# EasyEDA Pro project KeyTop.epro

# Schematic KeyTop
Board Name: KeyTop; Create Date: 2026-04-17; Page Name: Sheet_1; Project Name: Keytop; Schematic Name: KeyTop; Update Date: 2026-05-10; Add into BOM: yes; Company: Trust me bro; Convert to PCB: yes; Date: 2026-04-16; REV: 1.0; Sheet: 1/1; spicePre: .
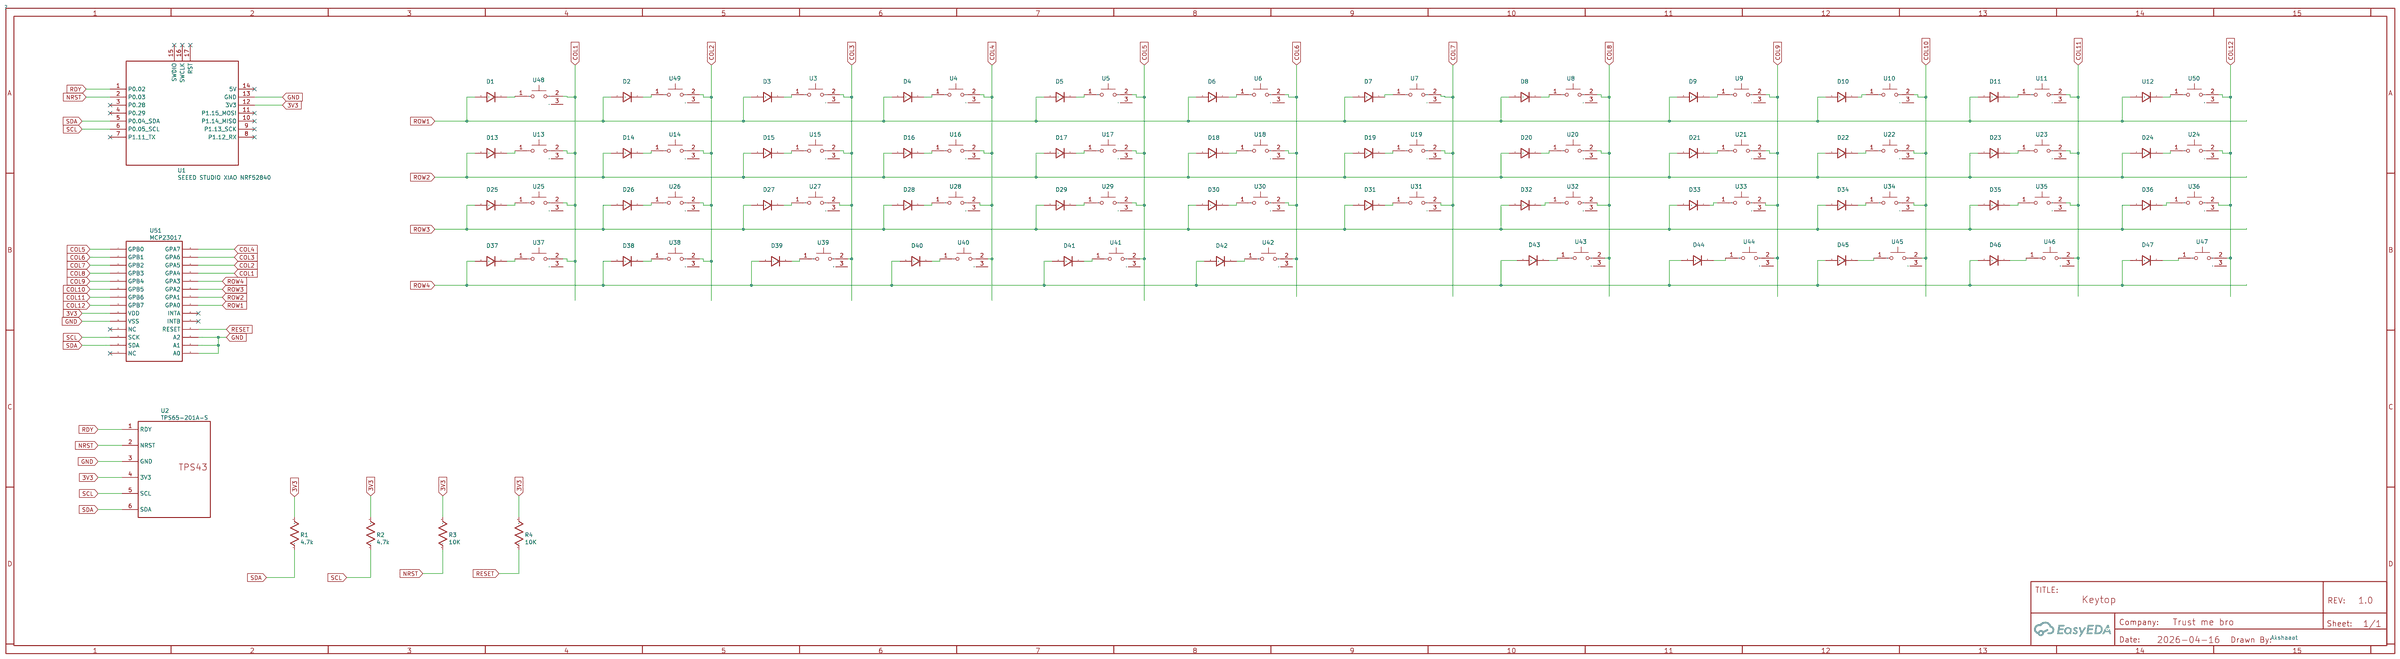
[diagram p0: schematic sheet]

## Parts
D1  1N4148  [SOD-123_L2.8-W1.8-LS3.7-RD]
D2  1N4148  [SOD-123_L2.8-W1.8-LS3.7-RD]
D3  1N4148  [SOD-123_L2.8-W1.8-LS3.7-RD]
D4  1N4148  [SOD-123_L2.8-W1.8-LS3.7-RD]
D5  1N4148  [SOD-123_L2.8-W1.8-LS3.7-RD]
D6  1N4148  [SOD-123_L2.8-W1.8-LS3.7-RD]
D7  1N4148  [SOD-123_L2.8-W1.8-LS3.7-RD]
D8  1N4148  [SOD-123_L2.8-W1.8-LS3.7-RD]
D9  1N4148  [SOD-123_L2.8-W1.8-LS3.7-RD]
D10  1N4148  [SOD-123_L2.8-W1.8-LS3.7-RD]
D11  1N4148  [SOD-123_L2.8-W1.8-LS3.7-RD]
D13  1N4148  [SOD-123_L2.8-W1.8-LS3.7-RD]
D14  1N4148  [SOD-123_L2.8-W1.8-LS3.7-RD]
D15  1N4148  [SOD-123_L2.8-W1.8-LS3.7-RD]
D16  1N4148  [SOD-123_L2.8-W1.8-LS3.7-RD]
D17  1N4148  [SOD-123_L2.8-W1.8-LS3.7-RD]
D18  1N4148  [SOD-123_L2.8-W1.8-LS3.7-RD]
D19  1N4148  [SOD-123_L2.8-W1.8-LS3.7-RD]
D20  1N4148  [SOD-123_L2.8-W1.8-LS3.7-RD]
D21  1N4148  [SOD-123_L2.8-W1.8-LS3.7-RD]
D22  1N4148  [SOD-123_L2.8-W1.8-LS3.7-RD]
D23  1N4148  [SOD-123_L2.8-W1.8-LS3.7-RD]
D24  1N4148  [SOD-123_L2.8-W1.8-LS3.7-RD]
D25  1N4148  [SOD-123_L2.8-W1.8-LS3.7-RD]
D26  1N4148  [SOD-123_L2.8-W1.8-LS3.7-RD]
D27  1N4148  [SOD-123_L2.8-W1.8-LS3.7-RD]
D28  1N4148  [SOD-123_L2.8-W1.8-LS3.7-RD]
D29  1N4148  [SOD-123_L2.8-W1.8-LS3.7-RD]
D30  1N4148  [SOD-123_L2.8-W1.8-LS3.7-RD]
D31  1N4148  [SOD-123_L2.8-W1.8-LS3.7-RD]
D32  1N4148  [SOD-123_L2.8-W1.8-LS3.7-RD]
D33  1N4148  [SOD-123_L2.8-W1.8-LS3.7-RD]
D34  1N4148  [SOD-123_L2.8-W1.8-LS3.7-RD]
D35  1N4148  [SOD-123_L2.8-W1.8-LS3.7-RD]
D36  1N4148  [SOD-123_L2.8-W1.8-LS3.7-RD]
D37  1N4148  [SOD-123_L2.8-W1.8-LS3.7-RD]
D38  1N4148  [SOD-123_L2.8-W1.8-LS3.7-RD]
D39  1N4148  [SOD-123_L2.8-W1.8-LS3.7-RD]
D40  1N4148  [SOD-123_L2.8-W1.8-LS3.7-RD]
D41  1N4148  [SOD-123_L2.8-W1.8-LS3.7-RD]
D42  1N4148  [SOD-123_L2.8-W1.8-LS3.7-RD]
D43  1N4148  [SOD-123_L2.8-W1.8-LS3.7-RD]
D44  1N4148  [SOD-123_L2.8-W1.8-LS3.7-RD]
D45  1N4148  [SOD-123_L2.8-W1.8-LS3.7-RD]
D46  1N4148  [SOD-123_L2.8-W1.8-LS3.7-RD]
D47  1N4148  [SOD-123_L2.8-W1.8-LS3.7-RD]
R1  4.7k  [R0603]
R2  4.7k  [R0603]
R3  10K  [R0603]
R4  10K  [R0603]
U1  SEEED STUDIO XIAO NRF52840  [SEEED STUDIO XIAO NRF52840]
U2  TPS65-201A-S  [TPS65-201A-S]
U3  CPG135301D02  [KEY-TH_CPG135301D02]
U4  CPG135301D02  [KEY-TH_CPG135301D02]
U5  CPG135301D02  [KEY-TH_CPG135301D02]
U6  CPG135301D02  [KEY-TH_CPG135301D02]
U7  CPG135301D02  [KEY-TH_CPG135301D02]
U8  CPG135301D02  [KEY-TH_CPG135301D02]
U9  CPG135301D02  [KEY-TH_CPG135301D02]
U10  CPG135301D02  [KEY-TH_CPG135301D02]
U11  CPG135301D02  [KEY-TH_CPG135301D02]
U12  1N4148  [SOD-123_L2.8-W1.8-LS3.7-RD]
U13  CPG135301D02  [KEY-TH_CPG135301D02]
U14  CPG135301D02  [KEY-TH_CPG135301D02]
U15  CPG135301D02  [KEY-TH_CPG135301D02]
U16  CPG135301D02  [KEY-TH_CPG135301D02]
U17  CPG135301D02  [KEY-TH_CPG135301D02]
U18  CPG135301D02  [KEY-TH_CPG135301D02]
U19  CPG135301D02  [KEY-TH_CPG135301D02]
U20  CPG135301D02  [KEY-TH_CPG135301D02]
U21  CPG135301D02  [KEY-TH_CPG135301D02]
U22  CPG135301D02  [KEY-TH_CPG135301D02]
U23  CPG135301D02  [KEY-TH_CPG135301D02]
U24  CPG135301D02  [KEY-TH_CPG135301D02]
U25  CPG135301D02  [KEY-TH_CPG135301D02]
U26  CPG135301D02  [KEY-TH_CPG135301D02]
U27  CPG135301D02  [KEY-TH_CPG135301D02]
U28  CPG135301D02  [KEY-TH_CPG135301D02]
U29  CPG135301D02  [KEY-TH_CPG135301D02]
U30  CPG135301D02  [KEY-TH_CPG135301D02]
U31  CPG135301D02  [KEY-TH_CPG135301D02]
U32  CPG135301D02  [KEY-TH_CPG135301D02]
U33  CPG135301D02  [KEY-TH_CPG135301D02]
U34  CPG135301D02  [KEY-TH_CPG135301D02]
U35  CPG135301D02  [KEY-TH_CPG135301D02]
U36  CPG135301D02  [KEY-TH_CPG135301D02]
U37  CPG135301D02  [KEY-TH_CPG135301D02]
U38  CPG135301D02  [KEY-TH_CPG135301D02]
U39  CPG135301D02  [KEY-TH_CPG135301D02]
U40  CPG135301D02  [KEY-TH_CPG135301D02]
U41  CPG135301D02  [KEY-TH_CPG135301D02]
U42  CPG135301D02  [KEY-TH_CPG135301D02]
U43  CPG135301D02  [KEY-TH_CPG135301D02]
U44  CPG135301D02  [KEY-TH_CPG135301D02]
U45  CPG135301D02  [KEY-TH_CPG135301D02]
U46  CPG135301D02  [KEY-TH_CPG135301D02]
U47  CPG135301D02  [KEY-TH_CPG135301D02]
U48  CPG135301D02  [KEY-TH_CPG135301D02]
U49  CPG135301D02  [KEY-TH_CPG135301D02]
U50  CPG135301D02  [KEY-TH_CPG135301D02]
U51  MCP23017  [MCP23017-E/SP]

## Library data of the parts
D1-D11 D13-D47 U12 = 1N4148: Supplier: LCSC; Supplier Part: C328592; Manufacturer: BLUE ROCKET; Manufacturer Part: 1N4007W; Contributor: LCEDA_Lib; spicePre: D; spiceSymbolName: 1N4007W
R1 R2 = 4.7k: nameAlias: Value(Ω); Contributor: LCEDA_Lib; spicePre: R; spiceSymbolName: R_0603_US
R3 R4 = 10K: nameAlias: Value(Ω); Contributor: LCEDA_Lib; spicePre: R; spiceSymbolName: R_0603_US
U1 = SEEED STUDIO XIAO NRF52840: Contributor: hafeneger; spicePre: U
U2 = TPS65-201A-S: Manufacturer: Azoteq; Supplier: Mouser; Supplier Part: 957-TPS65-201A-S; Link: https://www.mouser.pl/ProductDetail/Azoteq/TPS65-201A-S; Contributor: ilysnwflk; spicePre: U
U3-U11 U13-U50 = CPG135301D02: Supplier Part: C5142796; Manufacturer: Kailh(凯华); Supplier Footprint: 插件; JLCPCB Part Class: Extended Part; Datasheet: https://atta.szlcsc.com/upload/public/pdf/source/20240306/2B4750D694E677D5EFD80A0C9CA73C95.pdf; Supplier: LCSC
U51 = MCP23017: Contributor: bartvanhecke; spicePre: U

## Nets
3V3: R1.2 R2.2 R3.2 R4.2 U1.12(3V3) U2.4(3V3) U51.9(VDD)
GND: U1.13(GND) U2.3(GND) U51.10(VSS) U51.15(A0) U51.16(A1) U51.17(A2)
COL1: U13.2 U25.2 U37.2 U48.2 U51.25(GPA4)
COL2: U14.2 U26.2 U38.2 U49.2 U51.26(GPA5)
COL3: U3.2 U15.2 U27.2 U39.2 U51.27(GPA6)
COL4: U4.2 U16.2 U28.2 U40.2 U51.28(GPA7)
COL5: U5.2 U17.2 U29.2 U41.2 U51.1(GPB0)
COL6: U6.2 U18.2 U30.2 U42.2 U51.2(GPB1)
COL7: U7.2 U19.2 U31.2 U51.3(GPB2)
COL8: U8.2 U20.2 U32.2 U43.2 U51.4(GPB3)
COL9: U9.2 U21.2 U33.2 U44.2 U51.5(GPB4)
COL10: U10.2 U22.2 U34.2 U45.2 U51.6(GPB5)
COL11: U11.2 U23.2 U35.2 U46.2 U51.7(GPB6)
COL12: U24.2 U36.2 U47.2 U50.2 U51.8(GPB7)
NRST: R3.1 U1.2(P0.03) U2.2(NRST)
RDY: U1.1(P0.02) U2.1(RDY)
RESET: R4.1 U51.18(RESET)
ROW1: D1.2 D2.2 D3.2 D4.2 D5.2 D6.2 D7.2 D8.2 D9.2 D10.2 D11.2 U12.2 U51.21(GPA0)
ROW2: D13.2 D14.2 D15.2 D16.2 D17.2 D18.2 D19.2 D20.2 D21.2 D22.2 D23.2 D24.2 U51.22(GPA1)
ROW3: D25.2 D26.2 D27.2 D28.2 D29.2 D30.2 D31.2 D32.2 D33.2 D34.2 D35.2 D36.2 U51.23(GPA2)
ROW4: D37.2 D38.2 D39.2 D40.2 D41.2 D42.2 D43.2 D44.2 D45.2 D46.2 D47.2 U51.24(GPA3)
SCL: R2.1 U1.6(P0.05_SCL) U2.5(SCL) U51.12(SCK)
SDA: R1.1 U1.5(P0.04_SDA) U2.6(SDA) U51.13(SDA)
$1N28: D1.1 U48.1
$1N29: D2.1 U49.1
$1N30: D3.1 U3.1
$1N31: D4.1 U4.1
$1N32: D5.1 U5.1
$1N33: D6.1 U6.1
$1N34: D7.1 U7.1
$1N35: D8.1 U8.1
$1N36: D9.1 U9.1
$1N37: D10.1 U10.1
$1N38: D11.1 U11.1
$1N39: U12.1 U50.1
$1N40: D13.1 U13.1
$1N41: D14.1 U14.1
$1N42: D15.1 U15.1
$1N43: D16.1 U16.1
$1N44: D17.1 U17.1
$1N45: D18.1 U18.1
$1N46: D19.1 U19.1
$1N47: D20.1 U20.1
$1N48: D21.1 U21.1
$1N49: D22.1 U22.1
$1N50: D23.1 U23.1
$1N51: D24.1 U24.1
$1N52: D25.1 U25.1
$1N53: D26.1 U26.1
$1N54: D27.1 U27.1
$1N55: D28.1 U28.1
$1N56: D29.1 U29.1
$1N57: D30.1 U30.1
$1N58: D31.1 U31.1
$1N59: D32.1 U32.1
$1N60: D33.1 U33.1
$1N61: D34.1 U34.1
$1N62: D35.1 U35.1
$1N63: D36.1 U36.1
$1N64: D37.1 U37.1
$1N65: D38.1 U38.1
$1N66: D39.1 U39.1
$1N67: D40.1 U40.1
$1N68: D41.1 U41.1
$1N69: D42.1 U42.1
$1N70: D43.1 U43.1
$1N71: D44.1 U44.1
$1N72: D45.1 U45.1
$1N73: D46.1 U46.1
$1N74: D47.1 U47.1

Not connected (* = marked no-connect by the designer): U1 3(P0.28)* 4(P0.29)* 7(P1.11_TX)* 8(P1.12_RX)* 9(P1.13_SCK)* 10(P1.14_MISO)* 11(P1.15_MOSI)* 14(5V)* 15(SWDIO)* 16(SWCLK)* 17(RST)*; U3 3; U4 3; U5 3; U6 3; U7 3; U8 3; U9 3; U10 3; U11 3; U13 3; U14 3; U15 3; U16 3; U17 3; U18 3; U19 3; U20 3; U21 3; U22 3; U23 3; U24 3; U25 3; U26 3; U27 3; U28 3; U29 3; U30 3; U31 3; U32 3; U33 3; U34 3; U35 3; U36 3; U37 3; U38 3; U39 3; U40 3; U41 3; U42 3; U43 3; U44 3; U45 3; U46 3; U47 3; U48 3; U49 3; U50 3; U51 11(NC)* 14(NC)* 19(INTB)* 20(INTA)*

## Notes on the sheet
- Akshaaat

# Board PCB_PCB_KeyTop_2026-04-17
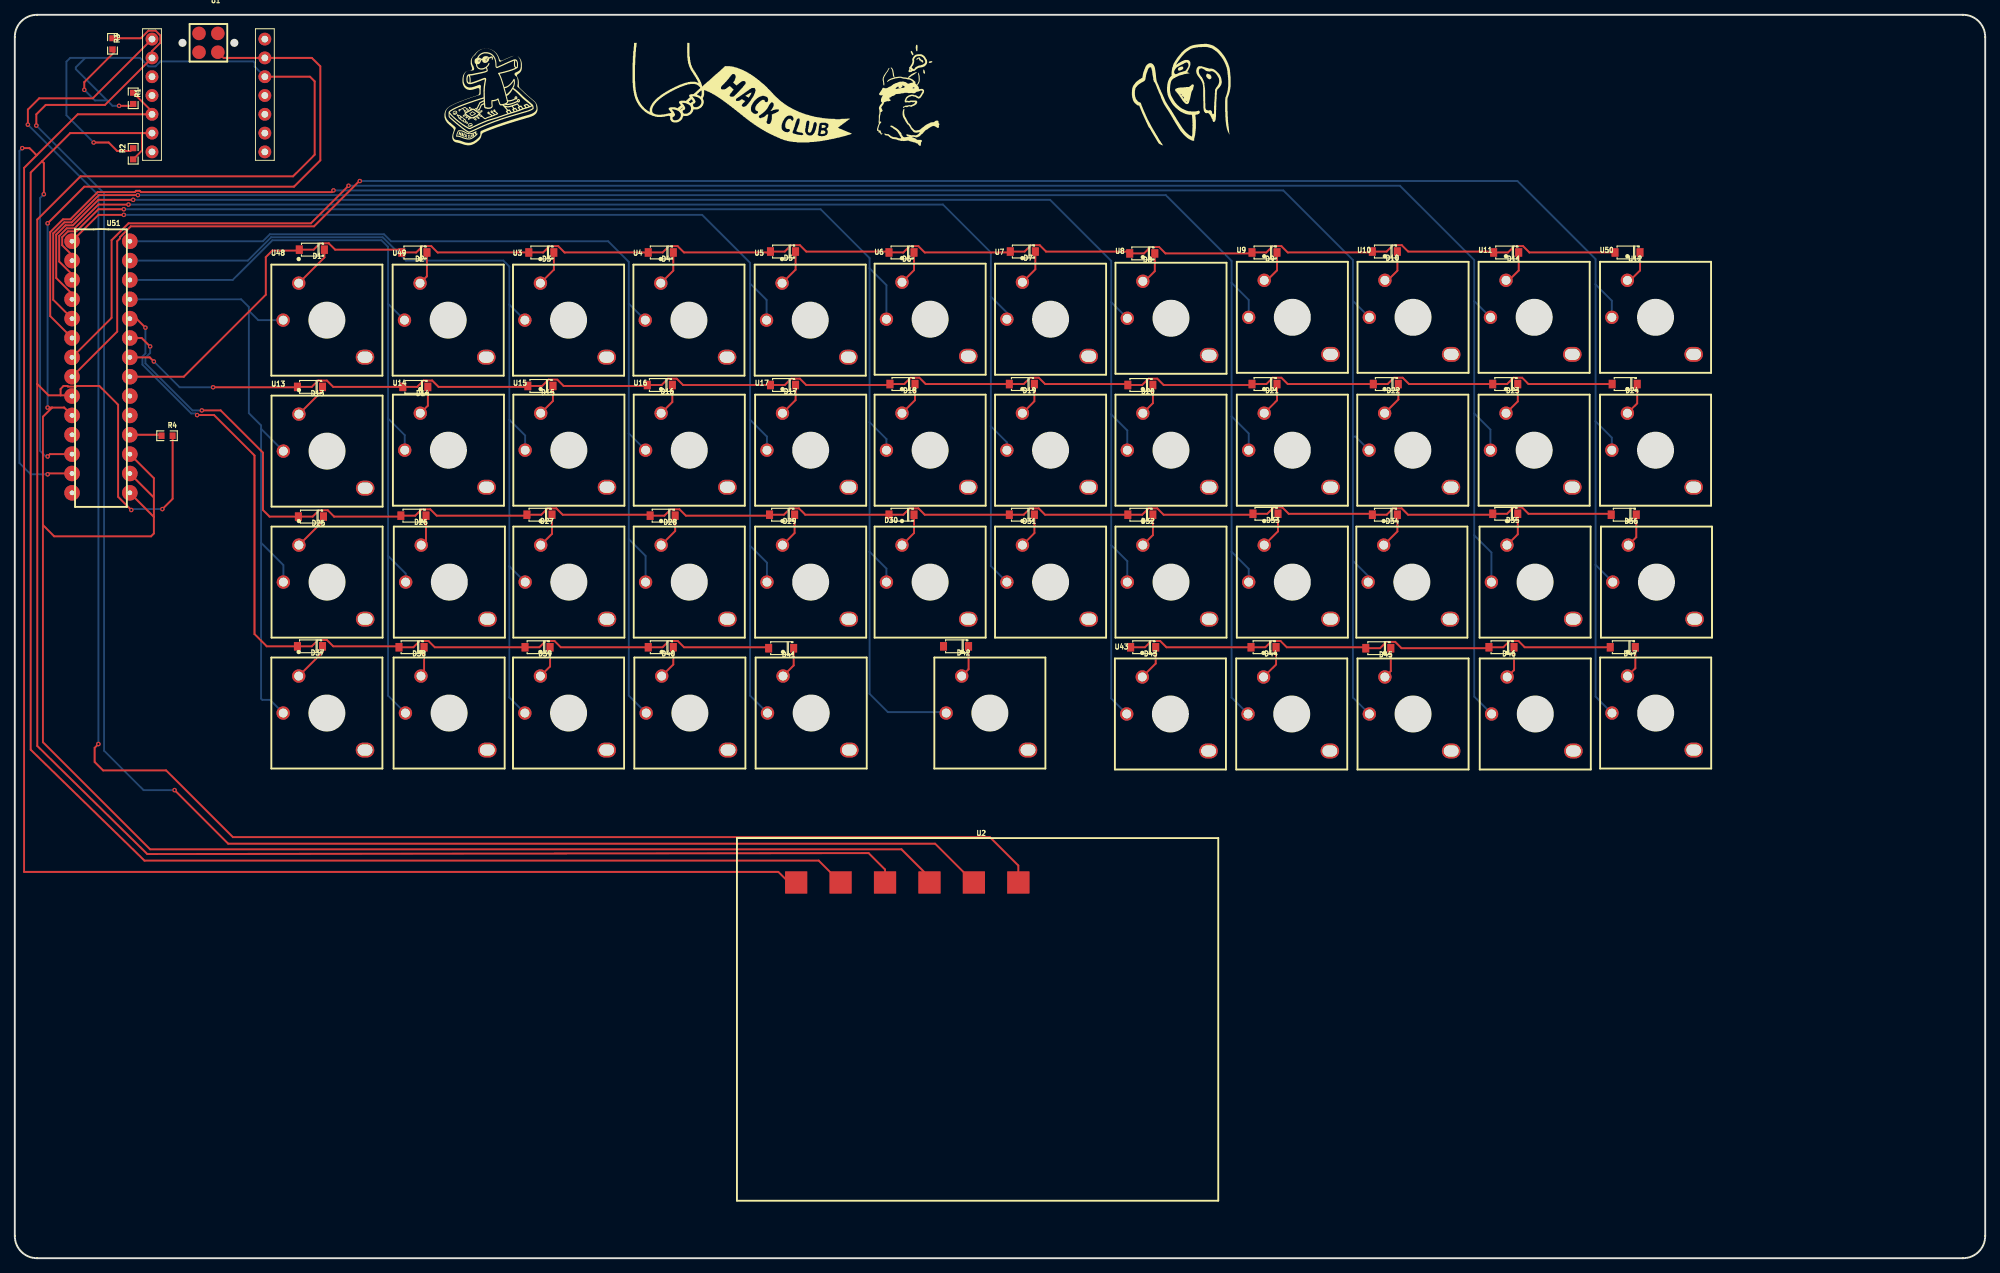
[diagram p1: board, top side]
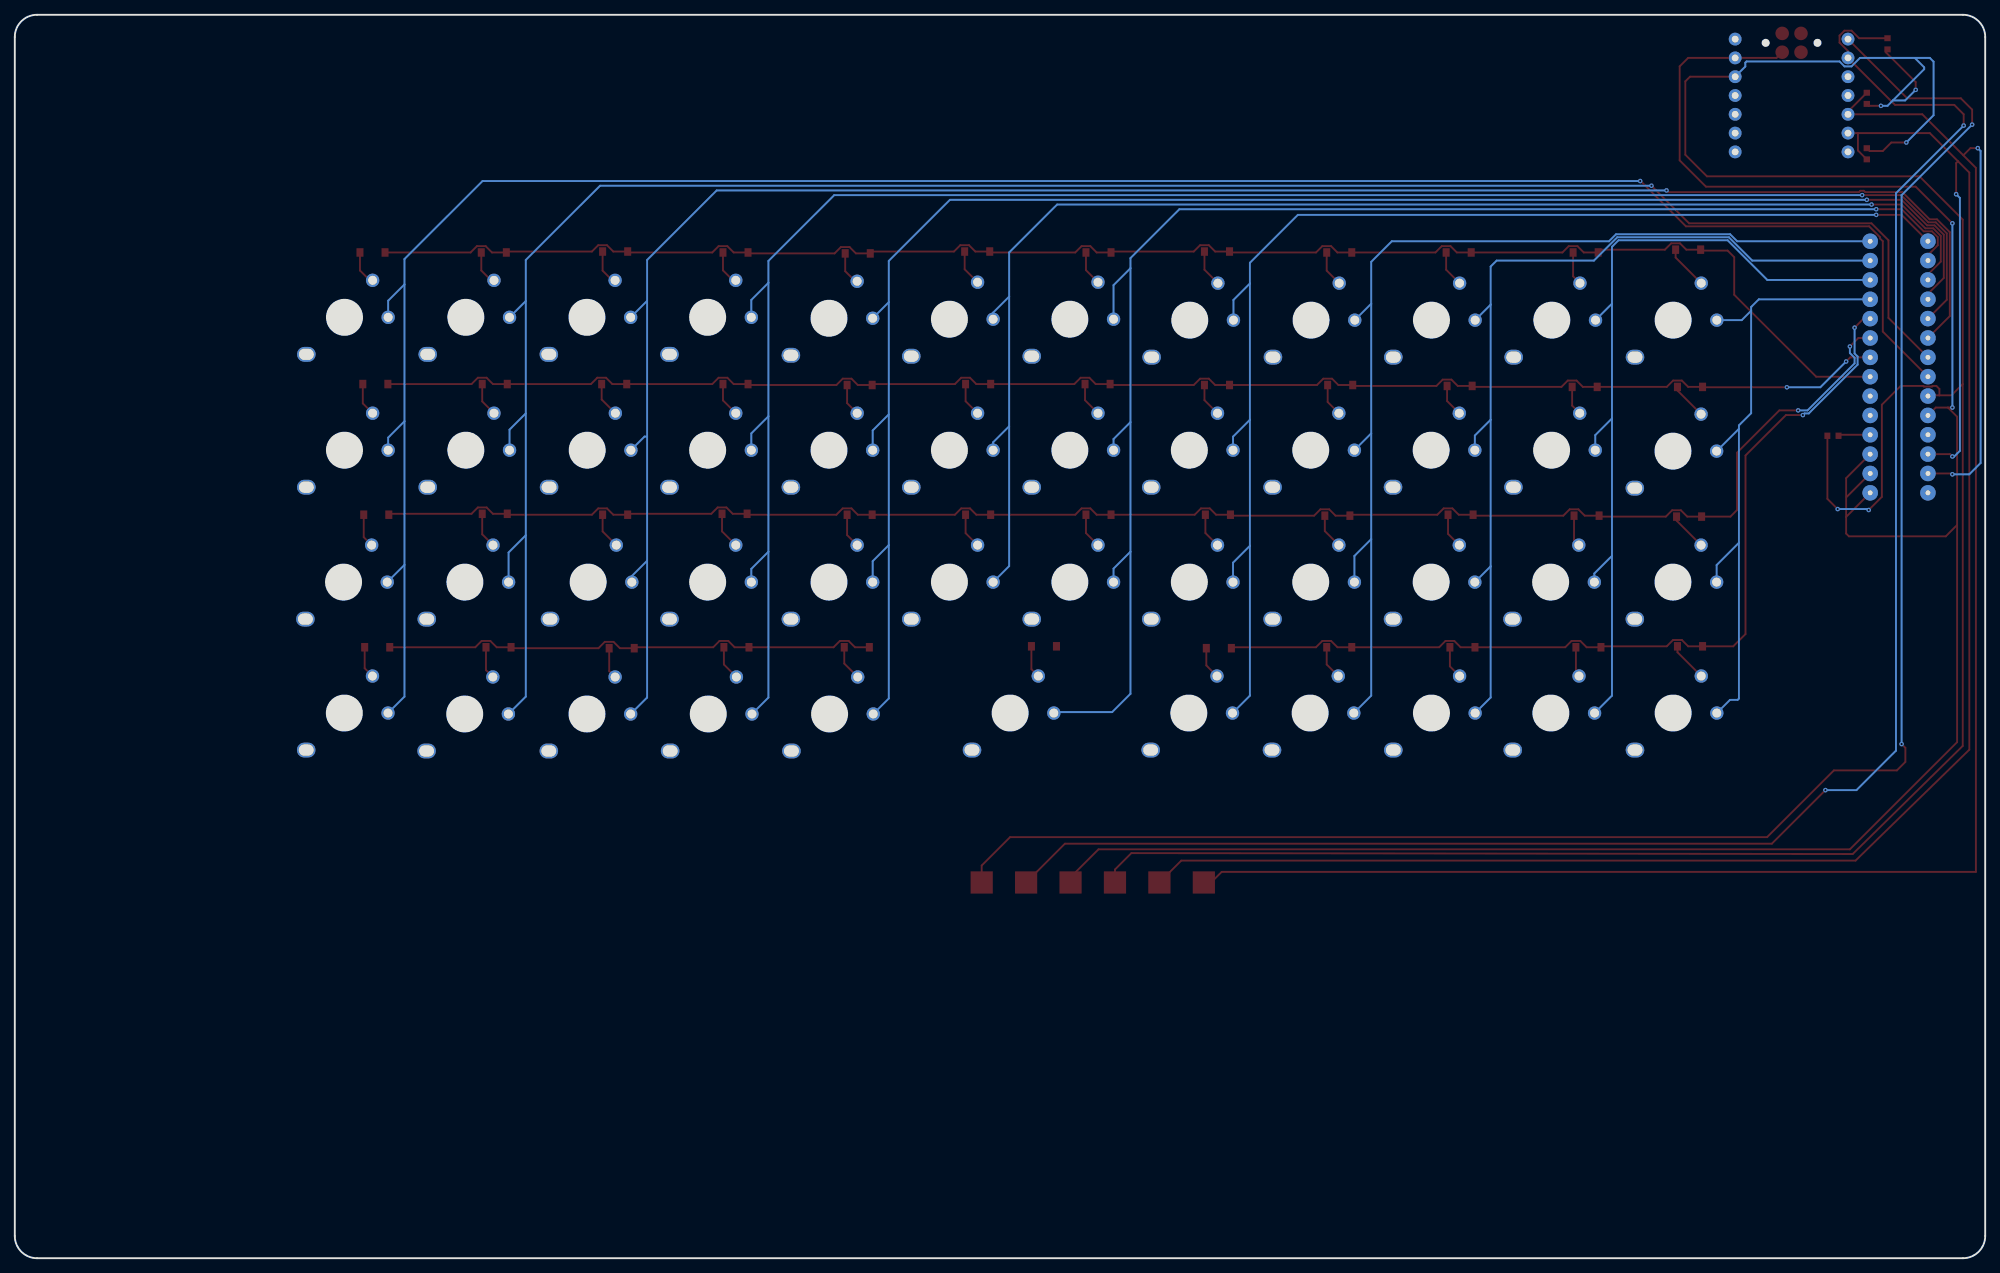
[diagram p2: board, bottom side, seen from below]

Outline 266.1 x 168 mm; copper layers: Top Layer, Bottom Layer. Coordinates in mm from the lower left corner of the outline.
Outline path: 0,165 arc(0.88,167.12) 3,168 263.1,168 arc(265.22,167.12) 266.1,165 266.1,3 arc(265.22,0.88) 263.1,0 3,0 arc(0.88,0.88) 0,3 0,165
Stack: Top Layer 0.035mm / Dielectric1 1.51mm FR4 er 4.5 / Bottom Layer 0.035mm

## Design rules (mm)
spacing Default (default): track to track 0.152, other pairs 0 to 0.152
track width Default (default): min 0.254, default 0.254, max 25.4
differential pair differentialPair (default): width min 0.127, default 0.254, max 2.54; gap min 0.152, default 0.152
via Default (default): diameter min 0.61, default 0.61, max 100.025; hole min 0.305, default 0.305, max 59.995

## Placement (name value [footprint] x y rotation side)
D1  1N4148  [SOD-123_L2.8-W1.8-LS3.7-RD]  40.12 136.27 180 top
D2  1N4148  [SOD-123_L2.8-W1.8-LS3.7-RD]  53.96 135.89 180 top
D3  1N4148  [SOD-123_L2.8-W1.8-LS3.7-RD]  71.11 135.89 180 top
D4  1N4148  [SOD-123_L2.8-W1.8-LS3.7-RD]  87.23 135.89 180 top
D5  1N4148  [SOD-123_L2.8-W1.8-LS3.7-RD]  103.74 136.01 180 top
D6  1N4148  [SOD-123_L2.8-W1.8-LS3.7-RD]  119.75 135.89 180 top
D7  1N4148  [SOD-123_L2.8-W1.8-LS3.7-RD]  136.13 136.01 180 top
D8  1N4148  [SOD-123_L2.8-W1.8-LS3.7-RD]  152.26 135.76 180 top
D9  1N4148  [SOD-123_L2.8-W1.8-LS3.7-RD]  168.77 135.89 180 top
D10  1N4148  [SOD-123_L2.8-W1.8-LS3.7-RD]  185.02 136.01 180 top
D11  1N4148  [SOD-123_L2.8-W1.8-LS3.7-RD]  201.41 135.89 180 top
D13  1N4148  [SOD-123_L2.8-W1.8-LS3.7-RD]  39.86 117.73 180 top
D14  1N4148  [SOD-123_L2.8-W1.8-LS3.7-RD]  54.09 117.73 180 top
D15  1N4148  [SOD-123_L2.8-W1.8-LS3.7-RD]  70.98 117.85 180 top
D16  1N4148  [SOD-123_L2.8-W1.8-LS3.7-RD]  87.11 117.98 180 top
D17  1N4148  [SOD-123_L2.8-W1.8-LS3.7-RD]  103.74 117.98 180 top
D18  1N4148  [SOD-123_L2.8-W1.8-LS3.7-RD]  119.87 118.11 180 top
D19  1N4148  [SOD-123_L2.8-W1.8-LS3.7-RD]  136 118.11 180 top
D20  1N4148  [SOD-123_L2.8-W1.8-LS3.7-RD]  152 117.98 180 top
D21  1N4148  [SOD-123_L2.8-W1.8-LS3.7-RD]  168.77 118.11 180 top
D22  1N4148  [SOD-123_L2.8-W1.8-LS3.7-RD]  185.15 118.11 180 top
D23  1N4148  [SOD-123_L2.8-W1.8-LS3.7-RD]  201.28 118.11 180 top
D24  1N4148  [SOD-123_L2.8-W1.8-LS3.7-RD]  217.41 118.11 180 top
D25  1N4148  [SOD-123_L2.8-W1.8-LS3.7-RD]  39.99 100.2 180 top
D26  1N4148  [SOD-123_L2.8-W1.8-LS3.7-RD]  53.83 100.33 180 top
D27  1N4148  [SOD-123_L2.8-W1.8-LS3.7-RD]  70.85 100.45 180 top
D28  1N4148  [SOD-123_L2.8-W1.8-LS3.7-RD]  87.49 100.33 180 top
D29  1N4148  [SOD-123_L2.8-W1.8-LS3.7-RD]  103.62 100.45 180 top
D30  1N4148  [SOD-123_L2.8-W1.8-LS3.7-RD]  119.75 100.45 180 top
D31  1N4148  [SOD-123_L2.8-W1.8-LS3.7-RD]  136 100.45 180 top
D32  1N4148  [SOD-123_L2.8-W1.8-LS3.7-RD]  152 100.45 180 top
D33  1N4148  [SOD-123_L2.8-W1.8-LS3.7-RD]  168.9 100.58 180 top
D34  1N4148  [SOD-123_L2.8-W1.8-LS3.7-RD]  185.02 100.45 180 top
D35  1N4148  [SOD-123_L2.8-W1.8-LS3.7-RD]  201.28 100.58 180 top
D36  1N4148  [SOD-123_L2.8-W1.8-LS3.7-RD]  217.28 100.45 180 top
D37  1N4148  [SOD-123_L2.8-W1.8-LS3.7-RD]  39.86 82.67 180 top
D38  1N4148  [SOD-123_L2.8-W1.8-LS3.7-RD]  53.58 82.55 180 top
D39  1N4148  [SOD-123_L2.8-W1.8-LS3.7-RD]  70.6 82.55 180 top
D40  1N4148  [SOD-123_L2.8-W1.8-LS3.7-RD]  87.23 82.55 180 top
D41  1N4148  [SOD-123_L2.8-W1.8-LS3.7-RD]  103.49 82.42 180 top
D42  1N4148  [SOD-123_L2.8-W1.8-LS3.7-RD]  127.11 82.67 180 top
D43  1N4148  [SOD-123_L2.8-W1.8-LS3.7-RD]  152.38 82.55 180 top
D44  1N4148  [SOD-123_L2.8-W1.8-LS3.7-RD]  168.64 82.55 180 top
D45  1N4148  [SOD-123_L2.8-W1.8-LS3.7-RD]  184.13 82.42 180 top
D46  1N4148  [SOD-123_L2.8-W1.8-LS3.7-RD]  200.77 82.55 180 top
D47  1N4148  [SOD-123_L2.8-W1.8-LS3.7-RD]  217.16 82.55 180 top
R1  4.7k  [R0603]  15.99 156.72 270 top
R2  4.7k  [R0603]  15.99 149.22 90 top
R3  10K  [R0603]  13.19 164.08 270 top
R4  10K  [R0603]  20.56 111.12 0 top
U1  -  [SEEED STUDIO XIAO NRF52840]  26.15 157.1 0 top
U2  -  [TPS65-201A-S]  97.52 56.77 0 top
U3  CPG135301D02  [KEY-TH_CPG135301D02]  74.41 126.74 0 top
U4  CPG135301D02  [KEY-TH_CPG135301D02]  90.66 126.74 0 top
U5  CPG135301D02  [KEY-TH_CPG135301D02]  107.05 126.74 0 top
U6  CPG135301D02  [KEY-TH_CPG135301D02]  123.24 126.87 0 top
U7  CPG135301D02  [KEY-TH_CPG135301D02]  139.5 126.87 0 top
U8  CPG135301D02  [KEY-TH_CPG135301D02]  155.76 127 0 top
U9  CPG135301D02  [KEY-TH_CPG135301D02]  172.16 127.12 0 top
U10  CPG135301D02  [KEY-TH_CPG135301D02]  188.45 127.12 0 top
U11  CPG135301D02  [KEY-TH_CPG135301D02]  204.81 127.12 0 top
U12  1N4148  [SOD-123_L2.8-W1.8-LS3.7-RD]  217.79 135.89 180 top
U13  CPG135301D02  [KEY-TH_CPG135301D02]  41.79 109.05 0 top
U14  CPG135301D02  [KEY-TH_CPG135301D02]  58.18 109.17 0 top
U15  CPG135301D02  [KEY-TH_CPG135301D02]  74.45 109.17 0 top
U16  CPG135301D02  [KEY-TH_CPG135301D02]  90.71 109.17 0 top
U17  CPG135301D02  [KEY-TH_CPG135301D02]  107.1 109.17 0 top
U18  CPG135301D02  [KEY-TH_CPG135301D02]  123.24 109.17 0 top
U19  CPG135301D02  [KEY-TH_CPG135301D02]  139.5 109.17 0 top
U20  CPG135301D02  [KEY-TH_CPG135301D02]  155.76 109.17 0 top
U21  CPG135301D02  [KEY-TH_CPG135301D02]  172.16 109.17 0 top
U22  CPG135301D02  [KEY-TH_CPG135301D02]  188.42 109.17 0 top
U23  CPG135301D02  [KEY-TH_CPG135301D02]  204.81 109.17 0 top
U24  CPG135301D02  [KEY-TH_CPG135301D02]  221.2 109.17 0 top
U25  CPG135301D02  [KEY-TH_CPG135301D02]  41.79 91.35 0 top
U26  CPG135301D02  [KEY-TH_CPG135301D02]  58.31 91.35 0 top
U27  CPG135301D02  [KEY-TH_CPG135301D02]  74.45 91.35 0 top
U28  CPG135301D02  [KEY-TH_CPG135301D02]  90.71 91.35 0 top
U29  CPG135301D02  [KEY-TH_CPG135301D02]  107.1 91.35 0 top
U30  CPG135301D02  [KEY-TH_CPG135301D02]  123.24 91.35 0 top
U31  CPG135301D02  [KEY-TH_CPG135301D02]  139.5 91.35 0 top
U32  CPG135301D02  [KEY-TH_CPG135301D02]  155.76 91.35 0 top
U33  CPG135301D02  [KEY-TH_CPG135301D02]  172.16 91.35 0 top
U34  CPG135301D02  [KEY-TH_CPG135301D02]  188.29 91.35 0 top
U35  CPG135301D02  [KEY-TH_CPG135301D02]  204.94 91.35 0 top
U36  CPG135301D02  [KEY-TH_CPG135301D02]  221.33 91.35 0 top
U37  CPG135301D02  [KEY-TH_CPG135301D02]  41.77 73.66 0 top
U38  CPG135301D02  [KEY-TH_CPG135301D02]  58.28 73.66 0 top
U39  CPG135301D02  [KEY-TH_CPG135301D02]  74.41 73.66 0 top
U40  CPG135301D02  [KEY-TH_CPG135301D02]  90.79 73.66 0 top
U41  CPG135301D02  [KEY-TH_CPG135301D02]  107.17 73.66 0 top
U42  CPG135301D02  [KEY-TH_CPG135301D02]  131.3 73.66 0 top
U43  CPG135301D02  [KEY-TH_CPG135301D02]  155.69 73.53 0 top
U44  CPG135301D02  [KEY-TH_CPG135301D02]  172.07 73.53 0 top
U45  CPG135301D02  [KEY-TH_CPG135301D02]  188.45 73.53 0 top
U46  CPG135301D02  [KEY-TH_CPG135301D02]  204.96 73.53 0 top
U47  CPG135301D02  [KEY-TH_CPG135301D02]  221.22 73.66 0 top
U48  CPG135301D02  [KEY-TH_CPG135301D02]  41.77 126.74 0 top
U49  CPG135301D02  [KEY-TH_CPG135301D02]  58.15 126.74 0 top
U50  CPG135301D02  [KEY-TH_CPG135301D02]  221.2 127.12 0 top
U51  MCP23017  [MCP23017-E/SP]  7.73 137.41 0 top

## Footprints (pads in the part's own frame, mm; a bottom-side part is the same pattern mirrored in y, then rotated)
KEY-TH_CPG135301D02
  round 1.8 hole 1.2: 1(-3.425,5) 2(-5.525,0)
  oval 2.5x2 hole 2x1.5: 3(5.525,-5)
MCP23017-E/SP
  round 2.1 hole 0.65: 1(0,0) 2(0,-2.615) 3(0,-5.231) 4(0,-7.846) 5(0,-10.461) 6(0,-13.077) 7(0,-15.693) 8(0,-18.308) 9(0,-20.923) 10(0,-23.538) 11(0,-26.154) 12(0,-28.769) 13(0,-31.384) 14(0,-34) 15(7.8,-34) 16(7.8,-31.386) 17(7.8,-28.77) 18(7.8,-26.155) 19(7.8,-23.541) 20(7.8,-20.926) 21(7.8,-18.311) 22(7.8,-15.697) 23(7.8,-13.082) 24(7.8,-10.467) 25(7.8,-7.852) 26(7.8,-5.237) 27(7.8,-2.623) 28(7.8,-0.007)
R0603
  rect 0.806x0.864 smd: 1(-0.753,0) 2(0.753,0)
SEEED STUDIO XIAO NRF52840
  round 1.728 hole 0.914: 1(-7.62,7.62) 2(-7.62,5.08) 3(-7.62,2.54) 4(-7.62,0) 5(-7.62,-2.54) 6(-7.62,-5.08) 7(-7.62,-7.62) 8(7.62,-7.62) 9(7.62,-5.08) 10(7.62,-2.54) 11(7.62,0) 12(7.62,2.54) 13(7.62,5.08) 14(7.62,7.62)
  round 1.829 smd: 13(1.27,5.85) 15(-1.27,8.39) 16(1.27,8.39) 17(-1.27,5.85)
SOD-123_L2.8-W1.8-LS3.7-RD
  rect 0.95x1.15 smd: 1(-1.692,0) 2(1.692,0)
TPS65-201A-S
  rect 3x3 smd: 1(38,-6) 2(32,-6) 3(26,-6) 4(20,-6) 5(14,-6) 6(8,-6)

## Nets
As in the schematic.

Pads without a net: U1 3 4 7 8 9 10 11 14 15 16 17; U3 3; U4 3; U5 3; U6 3; U7 3; U8 3; U9 3; U10 3; U11 3; U13 3; U14 3; U15 3; U16 3; U17 3; U18 3; U19 3; U20 3; U21 3; U22 3; U23 3; U24 3; U25 3; U26 3; U27 3; U28 3; U29 3; U30 3; U31 3; U32 3; U33 3; U34 3; U35 3; U36 3; U37 3; U38 3; U39 3; U40 3; U41 3; U42 3; U43 3; U44 3; U45 3; U46 3; U47 3; U48 3; U49 3; U50 3; U51 11 14 19 20

## Via types
v1: diameter 0.62, hole 0.31, Top Layer to Bottom Layer, 10 vias
v2: diameter 0.61, hole 0.305, Top Layer to Bottom Layer, 19 vias

## Routing (per net, layer and track width the routed paths; a pad name or vN(x,y) marks a point on that pad's centre or on a via; arc(x,y) is an arc through that point)
3V3: length 367.4
  Top Layer w0.254: 3.03,118.11 3.03,69.21 17.89,54.61 115.3,54.73 117.52,52.51 117.52,50.77 ; 3.03,118.11 4.56,116.58 6.18,116.58 ; 3.03,118.11 3.03,140.33 8.88,146.17 37.58,146.17 40.5,149.09 40.5,159 39.86,159.64 33.77,159.64 ; R3.2 13.37,163.15 13.37,162.89 9.38,158.9 v2(9.38,157.86) ; 6.18,116.58 7.64,116.58 U51.9 ; 6.18,116.58 6.18,117.45 6.59,117.85 7.1,117.85 7.18,117.77 8.28,117.77 8.36,117.85 11.41,117.85 13.95,115.31 13.95,102.87 v2(15.73,101.09) ; v2(19.92,101.22) 21.31,102.6 R4.2 ; v2(14.08,155.7) 15.72,155.7 R1.2 ; R2.2 15.61,149.59 13.83,149.59 12.68,150.75 v2(10.65,150.75)
  Bottom Layer w0.254: 12.46,156.43 13.19,155.7 v2(14.08,155.7) ; 12.46,156.43 8.24,160.65 8.24,160.91 9.51,162.18 ; 12.46,156.43 10.81,156.43 v2(9.38,157.86) ; v2(19.92,101.22) 15.86,101.22 v2(15.73,101.09) ; 9.51,162.18 16.91,162.18 18.05,161.03 19,161.03 19.66,161.69 32.23,161.69 32.4,161.53 32.4,161.01 33.77,159.64 ; 9.51,162.18 7.48,162.18 6.97,161.67 6.97,154.43 v2(10.65,150.75)
GND: length 307
  Top Layer w0.254: 3.8,99.06 5.32,97.53 18.4,97.53 18.78,97.91 18.78,100.15 ; 3.8,99.06 3.8,69.72 18.27,55.24 119.75,55.24 123.52,51.47 123.52,50.77 ; 3.8,99.06 3.8,113.7 5.03,114.93 ; 5.03,114.93 v1(4.43,114.93) ; 5.03,114.93 6.67,114.93 U51.10 ; U51.16 18.71,102.85 ; U51.17 18.78,105.39 18.78,100.15 ; U1.13 28.19,162.18 40.12,162.18 41.26,161.03 41.26,148.33 37.7,144.78 9.38,144.78 v1(4.43,139.82) ; 18.78,100.15 15.53,103.41
  Bottom Layer w0.254: v1(4.43,139.82) v1(4.43,114.93)
COL1: length 89.9
  Bottom Layer w0.254: 33.26,112.06 33.26,96.66 ; 33.26,112.06 33.26,112.52 31.61,114.17 31.61,128.01 ; 33.26,112.06 U13.2 ; 33.26,96.66 33.26,75.61 33.44,75.44 34.47,75.44 U37.2 ; 33.26,96.66 36.27,93.65 U25.2 ; 31.61,128.01 31.61,128.52 30.57,129.56 U51.25 ; 31.61,128.01 32.88,126.74 U48.2
COL2: length 114.3
  Bottom Layer w0.254: U26.2 52.79,92.51 50.4,94.89 ; 50.4,113.46 52.66,111.2 U14.2 ; 50.4,113.46 50.4,128.97 ; 50.4,113.46 50.4,94.89 ; 50.4,94.89 50.4,76.01 U38.2 ; U49.2 50.4,128.97 ; 50.4,128.97 50.4,136.65 49.52,137.54 34.78,137.54 29.42,132.17 U51.26
COL3: length 126.4
  Bottom Layer w0.254: U51.27 31.46,134.79 34.62,137.94 49.68,137.94 52.84,134.79 65.98,134.79 66.79,133.98 66.79,128.84 ; U39.2 66.79,75.75 66.79,93.48 ; U15.2 68.92,111.15 66.79,113.29 ; 66.79,128.84 U3.2 ; 66.79,128.84 66.79,113.29 ; 66.79,93.48 U27.2 ; 66.79,93.48 66.79,113.29
COL4: length 144.4
  Bottom Layer w0.254: 82.92,111.44 82.92,128.97 ; 82.92,111.44 U16.2 ; 82.92,111.44 82.92,97.15 ; 82.92,128.97 U4.2 ; 82.92,128.97 82.92,134.62 80.13,137.4 50.8,137.4 49.85,138.35 34.45,138.35 33.5,137.4 U51.28 ; 82.92,97.15 82.92,76.01 U40.2 ; 82.92,97.15 85.19,94.88 U28.2
COL5: length 174.3
  Top Layer w0.254: U51.1 11.29,140.97 v2(14.72,140.97)
  Bottom Layer w0.254: U5.2 101.52,129.47 99.3,131.7 ; 99.3,131.7 99.3,113.28 ; 99.3,131.7 99.3,134.49 92.82,140.97 v2(14.72,140.97) ; 99.3,96.25 101.58,93.98 U29.2 ; 99.3,96.25 99.3,113.28 ; 99.3,96.25 99.3,76.01 U41.2 ; 99.3,113.28 101.58,111 U17.2
COL6: length 205
  Top Layer w0.254: U51.2 7.73,135.53 6.4,136.86 6.4,137.96 7.18,138.74 8.3,138.74 11.29,141.73 v2(14.72,141.73)
  Bottom Layer w0.254: U6.2 117.71,131.47 115.43,133.76 ; 115.43,112.96 115.43,95.46 ; 115.43,112.96 117.71,110.68 U18.2 ; 115.43,112.96 115.43,133.76 ; 115.43,95.46 115.43,76.26 117.9,73.78 125.65,73.78 U42.2 ; 115.43,95.46 117.71,93.17 U30.2 ; v2(14.72,141.73) 108.82,141.73 115.43,135.12 115.43,133.76
COL7: length 190.4
  Top Layer w0.254: U51.3 7.73,132.92 6,134.65 6,138.13 7.01,139.15 8.07,139.15 11.29,142.36 v2(15.35,142.36)
  Bottom Layer w0.254: 131.81,112.41 133.98,110.24 U19.2 ; 131.81,112.41 131.81,129.92 ; 131.81,112.41 131.81,93.51 U31.2 ; 131.81,129.92 133.98,127.76 U7.2 ; 131.81,129.92 131.81,135.89 125.33,142.36 v2(15.35,142.36)
COL8: length 234.3
  Top Layer w0.254: v2(15.99,143) 11.29,143 7.84,139.55 6.84,139.55 5.59,138.3 5.59,132.44 7.73,130.3 U51.4
  Bottom Layer w0.254: U8.2 148.07,129.17 ; 148.07,129.17 148.07,114.01 ; 148.07,129.17 148.07,134.74 139.81,143 v2(15.99,143) ; 148.07,114.01 150.24,111.84 U20.2 ; 148.07,114.01 148.07,96.35 ; U32.2 150.24,94.18 148.07,96.35 ; 148.07,96.35 148.07,75.62 U43.2
COL9: length 255.9
  Top Layer w0.254: v2(16.62,143.63) 11.35,143.63 7.67,139.96 6.68,139.96 5.18,138.47 5.18,129.5 U51.5
  Bottom Layer w0.254: 164.32,95.45 164.32,75.75 U44.2 ; 164.32,95.45 166.63,93.14 U33.2 ; 164.32,95.45 164.32,113.75 ; v2(16.62,143.63) 155.43,143.63 164.32,134.74 164.32,131.78 ; 164.32,131.78 164.32,113.75 ; 164.32,131.78 166.63,129.48 U9.2 ; 164.32,113.75 166.63,111.44 U21.2
COL10: length 269.9
  Top Layer w0.254: v2(43.04,144.27) 42.81,144.04 17.04,144.04 16.86,144.22 16.38,144.22 16.2,144.04 11.18,144.04 7.5,140.36 6.51,140.36 4.78,138.63 4.78,127.29 U51.6
  Bottom Layer w0.254: U34.2 182.77,92.17 180.71,94.23 ; 180.71,129.35 180.71,111.01 ; 180.71,129.35 U10.2 ; 180.71,129.35 180.71,134.87 171.31,144.27 v2(43.04,144.27) ; 180.71,111.01 181.06,111.01 U22.2 ; 180.71,111.01 180.71,94.23 ; U45.2 180.71,75.75 180.71,94.23
COL11: length 287.8
  Top Layer w0.254: v2(45.07,144.9) 39.99,139.82 15.35,139.82 13.07,137.54 13.07,127.05 U51.7
  Bottom Layer w0.254: U23.2 199.28,111.95 197.09,114.14 ; 197.09,129.32 197.09,114.14 ; 197.09,129.32 U11.2 ; 197.09,129.32 197.09,134.87 187.06,144.9 v2(45.07,144.9) ; 197.09,114.14 197.09,97.67 ; 197.09,97.67 199.41,95.35 U35.2 ; 197.09,97.67 197.09,75.88 U46.2
COL12: length 304
  Top Layer w0.254: U51.8 13.83,125.2 13.83,137.41 14.2,137.79 14.2,137.95 15.67,139.42 40.41,139.42 46.53,145.54 v2(46.59,145.54)
  Bottom Layer w0.254: U50.2 215.68,129.37 213.47,131.57 ; v2(46.59,145.54) 202.93,145.54 213.47,135 213.47,131.57 ; U47.2 213.47,75.88 213.47,93.68 ; 213.47,113.07 215.68,110.87 U24.2 ; 213.47,113.07 213.47,131.57 ; 213.47,113.07 213.47,93.68 ; 213.47,93.68 U36.2
NRST: length 244.1
  Top Layer w0.254: R3.1 17.03,164.83 18.05,165.86 19,165.86 19.67,165.19 19.67,164.24 18.53,163.1 U1.2 12.18,155.83 4.18,155.83 2.91,154.56 v1(2.91,153.03) ; 129.52,50.77 124.28,56 28.81,56 v1(21.58,63.24)
  Bottom Layer w0.254: v1(2.91,153.03) 12.05,143.89 12.05,68.58 17.38,63.24 v1(21.58,63.24)
RDY: length 245.8
  Top Layer w0.254: v1(11.29,69.47) 10.78,68.96 10.78,67.05 11.92,65.91 20.43,65.91 29.45,56.89 131.68,56.89 135.52,53.06 135.52,50.77 ; v1(1.76,153.16) 1.76,155.19 3.29,156.72 10.53,156.72 U1.1
  Bottom Layer w0.254: v1(11.29,69.47) 11.29,143.63 v1(1.76,153.16)
RESET: length 4.3
  Top Layer w0.254: R4.1 19.67,111.26 U51.18
ROW1: length 219
  Top Layer w0.254: U51.21 22.82,119.1 33.89,130.17 33.89,135.25 34.78,136.14 38.3,136.14 D1.2 40.37,136.27 41.22,137.12 42.4,137.12 43.25,136.27 51.89,136.27 D2.2 54.21,135.89 55.06,136.74 56.24,136.74 57.1,135.89 D3.2 71.35,135.89 72.21,136.74 73.39,136.74 74.24,135.89 D4.2 87.48,135.89 88.34,136.74 89.52,136.74 90.37,135.89 101.92,135.89 D5.2 103.99,136.01 104.85,136.87 106.03,136.87 106.88,136.01 117.93,136.01 D6.2 119.99,135.89 120.85,136.74 122.03,136.74 122.88,135.89 134.31,135.89 D7.2 136.38,136.01 137.23,136.87 138.41,136.87 139.27,136.01 150.31,136.01 D8.2 152.51,135.76 153.36,136.61 154.54,136.61 155.4,135.76 166.95,135.76 D9.2 169.02,135.89 169.87,136.74 171.05,136.74 171.91,135.89 183.2,135.89 D10.2 185.27,136.01 186.13,136.87 187.31,136.87 188.16,136.01 199.59,136.01 D11.2 201.66,135.89 202.51,136.74 203.69,136.74 204.54,135.89 U12.2
ROW2: length 209.9
  Top Layer w0.254: v2(18.78,121.16) 18.22,121.71 U51.22 ; v2(26.78,117.67) 38.12,117.67 D13.2 40.11,117.73 40.97,118.58 42.15,118.58 43,117.73 D14.2 54.33,117.73 55.19,118.58 56.37,118.58 57.22,117.73 69.16,117.73 D15.2 71.23,117.85 72.08,118.71 73.26,118.71 74.11,117.85 85.29,117.85 D16.2 87.36,117.98 88.21,118.83 89.39,118.83 90.24,117.98 D17.2 103.99,117.98 104.85,118.83 106.03,118.83 106.88,117.98 118.05,117.98 D18.2 120.12,118.11 120.97,118.96 122.16,118.96 123.01,118.11 D19.2 136.25,118.11 137.1,118.96 138.28,118.96 139.14,118.11 150.18,118.11 D20.2 152.25,117.98 153.11,118.83 154.29,118.83 155.14,117.98 166.95,117.98 D21.2 169.02,118.11 169.87,118.96 171.05,118.96 171.91,118.11 D22.2 185.4,118.11 186.25,118.96 187.43,118.96 188.29,118.11 D23.2 201.53,118.11 202.38,118.96 203.56,118.96 204.42,118.11 D24.2
  Bottom Layer w0.254: v2(26.78,117.67) 22.26,117.67 v2(18.78,121.16)
ROW3: length 225
  Top Layer w0.254: v2(18.27,123.19) 17.13,124.33 U51.23 ; D36.2 215.46,100.58 204.42,100.58 203.56,101.44 202.38,101.44 201.53,100.58 D35.2 199.46,100.45 188.16,100.45 187.31,101.31 186.13,101.31 185.27,100.45 D34.2 183.2,100.58 172.03,100.58 171.18,101.44 170,101.44 169.14,100.58 D33.2 167.08,100.45 155.14,100.45 154.29,101.31 153.11,101.31 152.25,100.45 D32.2 139.14,100.45 138.28,101.31 137.1,101.31 136.25,100.45 D31.2 122.88,100.45 122.03,101.31 120.85,101.31 119.99,100.45 D30.2 106.75,100.45 105.9,101.31 104.72,101.31 103.86,100.45 D29.2 101.8,100.33 90.62,100.33 89.77,101.18 88.59,101.18 87.74,100.33 D28.2 85.67,100.45 73.99,100.45 73.13,101.31 71.95,101.31 71.1,100.45 D27.2 69.03,100.33 56.97,100.33 56.12,101.18 54.94,101.18 54.08,100.33 D26.2 52.01,100.2 43.13,100.2 42.27,101.05 41.09,101.05 40.24,100.2 D25.2 34.4,100.2 33.51,101.09 33.51,108.84 27.8,114.55 v2(25.26,114.55)
  Bottom Layer w0.254: v2(25.26,114.55) 23.99,114.55 17.64,120.9 17.64,121.66 18.27,122.3 v2(18.27,123.19)
ROW4: length 192.9
  Top Layer w0.254: U51.24 16.42,126.94 v2(17.64,125.73) ; v2(24.62,113.92) 26.91,113.92 32.37,108.45 32.37,84.33 34.02,82.67 D37.2 40.11,82.67 40.97,83.53 42.15,83.53 43,82.67 51.76,82.67 D38.2 53.83,82.55 54.68,83.4 55.86,83.4 56.72,82.55 D39.2 70.84,82.55 71.7,83.4 72.88,83.4 73.73,82.55 D40.2 87.48,82.55 88.34,83.4 89.52,83.4 90.37,82.55 101.67,82.55 D41.2 ; D43.2 152.63,82.55 153.49,83.4 154.67,83.4 155.52,82.55 D44.2 168.89,82.55 169.74,83.4 170.92,83.4 171.78,82.55 182.32,82.55 D45.2 184.38,82.42 185.24,83.27 186.42,83.27 187.27,82.42 198.95,82.42 D46.2 201.02,82.55 201.87,83.4 203.06,83.4 203.91,82.55 D47.2
  Bottom Layer w0.254: v2(17.64,125.73) 17.64,122.24 17.23,121.83 17.23,120.73 23.82,114.14 24.39,114.14 v2(24.62,113.92)
SCL: length 261.5
  Top Layer w0.254: v1(4.43,108.33) 4.74,108.64 U51.12 ; 111.52,50.77 108.57,53.72 17.51,53.72 2.14,68.7 2.14,146.68 3.68,148.21 ; 17.19,152.02 17.19,149.67 R2.1 ; 17.19,152.02 7.48,152.02 3.68,148.21 ; 17.19,152.02 U1.6 ; v1(3.92,143.76) 3.92,147.97 3.68,148.21
  Bottom Layer w0.254: v1(3.92,143.76) 3.41,143.25 3.41,109.09 4.18,108.33 v1(4.43,108.33)
SDA: length 277.1
  Top Layer w0.254: 2.95,149.02 1.99,149.98 v1(1,149.98) ; 2.95,149.02 8.49,154.56 U1.5 18.53,154.93 R1.1 ; 2.95,149.02 1.25,147.32 1.25,52.19 103.11,52.19 104.54,50.77 U2.6 ; U51.13 4.54,106.03 v1(4.43,105.92)
  Bottom Layer w0.254: v1(1,149.98) 0.62,149.6 0.62,107.44 2.14,105.92 v1(4.43,105.92)
$1N28: length 6
  Top Layer w0.254: 38.34,131.74 41.81,135.21 D1.1
$1N29: length 4.5
  Top Layer w0.254: D2.1 55.65,132.67 54.73,131.74
$1N30: length 4.9
  Top Layer w0.254: D3.1 72.8,133.56 70.98,131.74
$1N31: length 4.8
  Top Layer w0.254: D4.1 88.93,133.43 87.24,131.74
$1N32: length 5
  Top Layer w0.254: D5.1 105.44,133.56 103.62,131.74
$1N33: length 4.7
  Top Layer w0.254: 119.81,131.87 121.44,133.5 D6.1
$1N34: length 4.9
  Top Layer w0.254: 136.08,131.87 137.82,133.62 D7.1
$1N35: length 4.7
  Top Layer w0.254: D8.1 153.95,133.35 152.34,131.74
$1N36: length 4.9
  Top Layer w0.254: 168.73,131.74 170.46,133.47 D9.1
$1N37: length 5
  Top Layer w0.254: 185.03,131.74 186.72,133.43 D10.1
$1N38: length 4.9
  Top Layer w0.254: 201.38,131.74 203.1,133.46 D11.1
$1N39: length 4.9
  Top Layer w0.254: 217.78,131.74 219.48,133.45 U12.1
$1N40: length 5
  Top Layer w0.254: D13.1 41.56,117.23 U13.1
$1N41: length 4
  Top Layer w0.254: U14.1 55.78,115.19 D14.1
$1N42: length 4.4
  Top Layer w0.254: D15.1 72.67,115.82 U15.1
$1N43: length 4.4
  Top Layer w0.254: U16.1 88.8,115.69 D16.1
$1N44: length 4.5
  Top Layer w0.254: U17.1 105.44,115.93 D17.1
$1N45: length 4.7
  Top Layer w0.254: D18.1 121.57,115.93 U18.1
$1N46: length 4.6
  Top Layer w0.254: D19.1 137.69,115.79 U19.1
$1N47: length 4.4
  Top Layer w0.254: D20.1 153.7,115.53 U20.1
$1N48: length 4.7
  Top Layer w0.254: U21.1 170.46,115.9 D21.1
$1N49: length 4.7
  Top Layer w0.254: D22.1 186.84,116.02 U22.1
$1N50: length 4.6
  Top Layer w0.254: U23.1 202.97,115.76 D23.1
$1N51: length 4.5
  Top Layer w0.254: U24.1 219.1,115.5 D24.1
$1N52: length 5.2
  Top Layer w0.254: D25.1 41.68,99.66 U25.1
$1N53: length 4.2
  Top Layer w0.254: D26.1 55.53,96.99 U26.1
$1N54: length 4.7
  Top Layer w0.254: U27.1 72.54,97.87 D27.1
$1N55: length 4.8
  Top Layer w0.254: U28.1 89.18,98.24 D28.1
$1N56: length 4.8
  Top Layer w0.254: D29.1 105.31,97.98 U29.1
$1N57: length 4.8
  Top Layer w0.254: D30.1 121.44,97.97 U30.1
$1N58: length 4.8
  Top Layer w0.254: D31.1 137.69,97.97 U31.1
$1N59: length 4.7
  Top Layer w0.254: U32.1 153.7,97.7 D32.1
$1N60: length 5
  Top Layer w0.254: D33.1 170.59,98.2 U33.1
$1N61: length 4.9
  Top Layer w0.254: U34.1 186.72,98.2 D34.1
$1N62: length 4.8
  Top Layer w0.254: U35.1 202.97,97.81 D35.1
$1N63: length 4.6
  Top Layer w0.254: D36.1 218.97,97.42 U36.1
$1N64: length 5.3
  Top Layer w0.254: U37.1 41.56,81.87 D37.1
$1N65: length 4.1
  Top Layer w0.254: 54.85,78.66 55.27,79.08 D38.1
$1N66: length 4.4
  Top Layer w0.254: D39.1 72.29,79.96 U39.1
$1N67: length 4.5
  Top Layer w0.254: 87.36,78.66 88.93,80.22 D40.1
$1N68: length 4.4
  Top Layer w0.254: U41.1 105.18,80.09 D41.1
$1N69: length 4.4
  Top Layer w0.254: U42.1 128.8,79.58 D42.1
$1N70: length 4.8
  Top Layer w0.254: U43.1 154.08,80.35 D43.1
$1N71: length 4.7
  Top Layer w0.254: D44.1 170.33,80.22 U44.1
$1N72: length 4.2
  Top Layer w0.254: U45.1 185.83,79.33 D45.1
$1N73: length 4.4
  Top Layer w0.254: U46.1 202.46,79.46 D46.1
$1N74: length 4.3
  Top Layer w0.254: D47.1 218.85,79.71 U47.1
